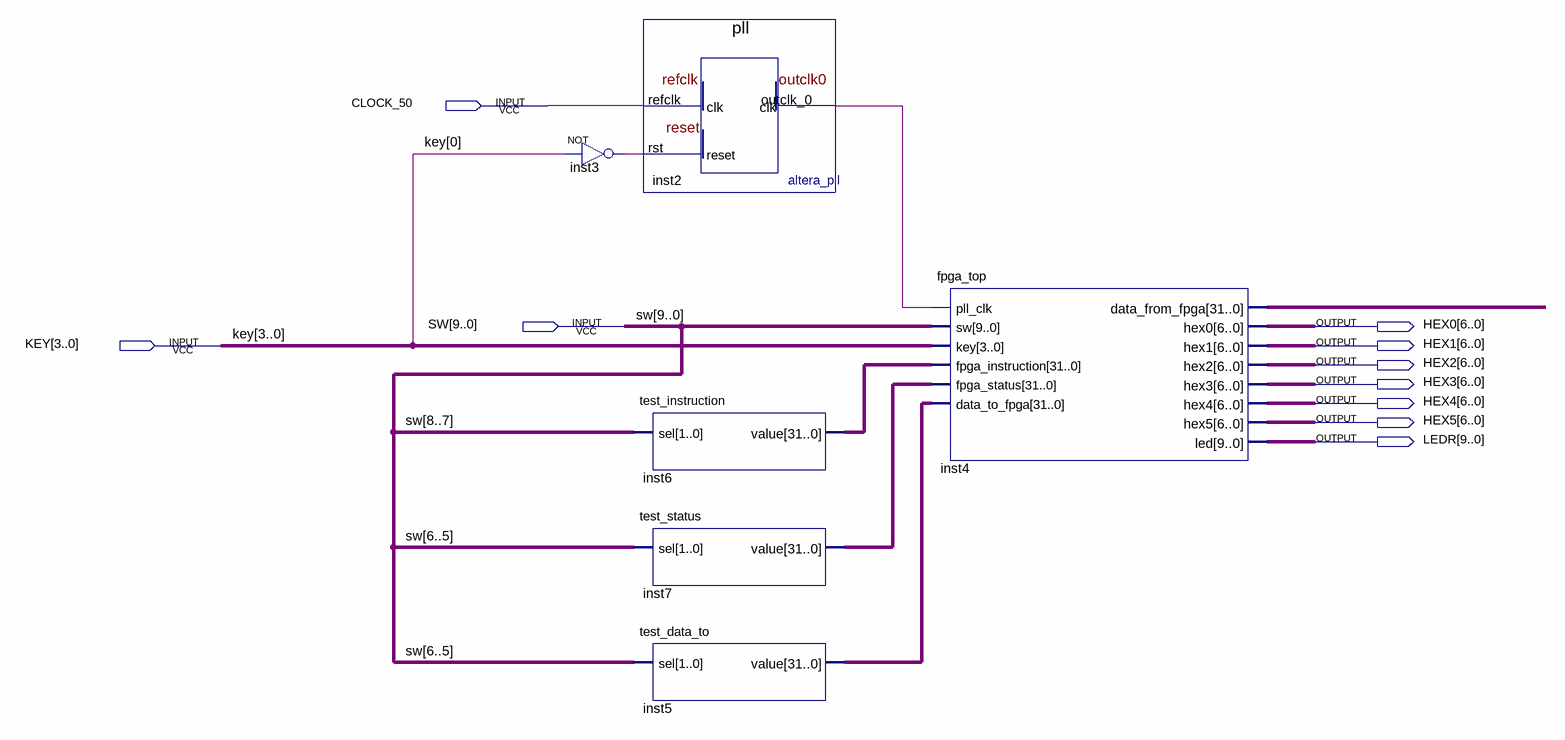
[diagram p0: schematic sheet]
// Quartus schematic fpga_Project.bdf as structural Verilog: 6 symbols, 10 pins
module fpga_Project (
  input  CLOCK_50,
  input  [9:0] SW,
  input  [3:0] KEY,
  output [6:0] HEX0,
  output [6:0] HEX1,
  output [6:0] HEX2,
  output [6:0] HEX3,
  output [6:0] HEX4,
  output [6:0] HEX5,
  output [9:0] LEDR
);

  wire inst2_outclk_0, inst3_out;
  wire [31:0] inst4_data_from_fpga, inst5_value, inst6_value, inst7_value;

  not inst3 (inst3_out, KEY[0]);
  pll inst2 (.refclk(CLOCK_50), .rst(inst3_out), .outclk_0(inst2_outclk_0));
  test_instruction inst6 (.sel(SW[8:7]), .value(inst6_value));
  test_status inst7 (.sel(SW[6:5]), .value(inst7_value));
  test_data_to inst5 (.sel(SW[6:5]), .value(inst5_value));
  fpga_top inst4 (
    .pll_clk(inst2_outclk_0), .sw(SW), .key(KEY), .fpga_instruction(inst6_value), .fpga_status(inst7_value),
    .data_to_fpga(inst5_value), .data_from_fpga(inst4_data_from_fpga), .hex0(HEX0), .hex1(HEX1), .hex2(HEX2),
    .hex3(HEX3), .hex4(HEX4), .hex5(HEX5), .led(LEDR));
endmodule
